# Altium schematic sheet Microcontroller.SchDoc
size Letter
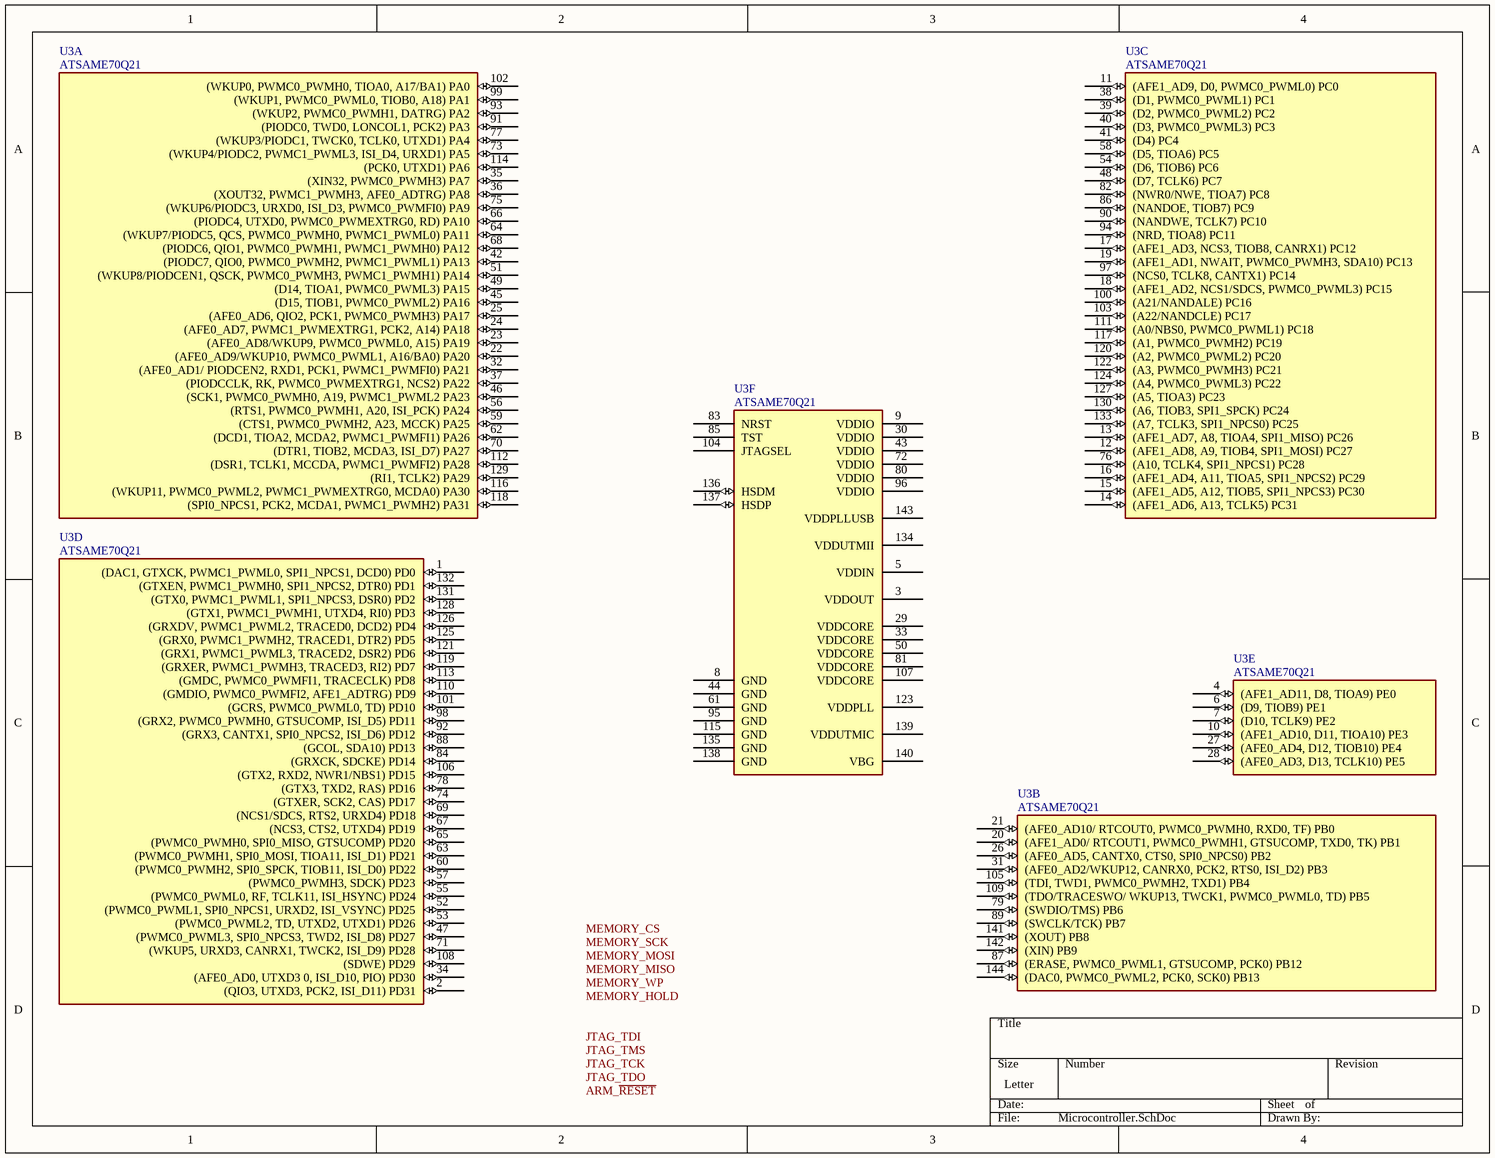
[diagram p0: Microcontroller.SchDoc]

## Parts
U3  ATSAME70Q21  [Atmel 144AA_M]  (parts A,B,C,D,E,F of 6)

## Nets

Not connected (* = marked no-connect by the designer): U3 1((DAC1,_GTXCK,_PWMC1_PWML0,_SPI1_NPCS1,_DCD0)_PD0) 2((QIO3,_UTXD3,_PCK2,_ISI_D11)_PD31) 3(VDDOUT) 4((AFE1_AD11,_D8,_TIOA9)_PE0) 5(VDDIN) 6((D9,_TIOB9)_PE1) 7((D10,_TCLK9)_PE2) 8(GND) 9(VDDIO) 10((AFE1_AD10,_D11,_TIOA10)_PE3) 11((AFE1_AD9,_D0,_PWMC0_PWML0)_PC0) 12((AFE1_AD8,_A9,_TIOB4,_SPI1_MOSI)_PC27) 13((AFE1_AD7,_A8,_TIOA4,_SPI1_MISO)_PC26) 14((AFE1_AD6,_A13,_TCLK5)_PC31) 15((AFE1_AD5,_A12,_TIOB5,_SPI1_NPCS3)_PC30) 16((AFE1_AD4,_A11,_TIOA5,_SPI1_NPCS2)_PC29) 17((AFE1_AD3,_NCS3,_TIOB8,_CANRX1)_PC12) 18((AFE1_AD2,_NCS1/SDCS,_PWMC0_PWML3)_PC15) 19((AFE1_AD1,_NWAIT,_PWMC0_PWMH3,_SDA10)_PC13) 20((AFE1_AD0/_RTCOUT1,_PWMC0_PWMH1,_GTSUCOMP,_TXD0,_TK)_PB1) 21((AFE0_AD10/_RTCOUT0,_PWMC0_PWMH0,_RXD0,_TF)_PB0) 22((AFE0_AD9/WKUP10,_PWMC0_PWML1,_A16/BA0)_PA20) 23((AFE0_AD8/WKUP9,_PWMC0_PWML0,_A15)_PA19) 24((AFE0_AD7,_PWMC1_PWMEXTRG1,_PCK2,_A14)_PA18) 25((AFE0_AD6,_QIO2,_PCK1,_PWMC0_PWMH3)_PA17) 26((AFE0_AD5,_CANTX0,_CTS0,_SPI0_NPCS0)_PB2) 27((AFE0_AD4,_D12,_TIOB10)_PE4) 28((AFE0_AD3,_D13,_TCLK10)_PE5) 29(VDDCORE) 30(VDDIO) 31((AFE0_AD2/WKUP12,_CANRX0,_PCK2,_RTS0,_ISI_D2)_PB3) 32((AFE0_AD1/_PIODCEN2,_RXD1,_PCK1,_PWMC1_PWMFI0)_PA21) 33(VDDCORE) 34((AFE0_AD0,_UTXD3_0,_ISI_D10,_PIO)_PD30) 35((XIN32,_PWMC0_PWMH3)_PA7) 36((XOUT32,_PWMC1_PWMH3,_AFE0_ADTRG)_PA8) 37((PIODCCLK,_RK,_PWMC0_PWMEXTRG1,_NCS2)_PA22) 38((D1,_PWMC0_PWML1)_PC1) 39((D2,_PWMC0_PWML2)_PC2) 40((D3,_PWMC0_PWML3)_PC3) 41((D4)_PC4) 42((PIODC7,_QIO0,_PWMC0_PWMH2,_PWMC1_PWML1)_PA13) 43(VDDIO) 44(GND) 45((D15,_TIOB1,_PWMC0_PWML2)_PA16) 46((SCK1,_PWMC0_PWMH0,_A19,_PWMC1_PWML2_PA23) 47((PWMC0_PWML3,_SPI0_NPCS3,_TWD2,_ISI_D8)_PD27) 48((D7,_TCLK6)_PC7) 49((D14,_TIOA1,_PWMC0_PWML3)_PA15) 50(VDDCORE) 51((WKUP8/PIODCEN1,_QSCK,_PWMC0_PWMH3,_PWMC1_PWMH1)_PA14) 52((PWMC0_PWML1,_SPI0_NPCS1,_URXD2,_ISI_VSYNC)_PD25) 53((PWMC0_PWML2,_TD,_UTXD2,_UTXD1)_PD26) 54((D6,_TIOB6)_PC6) 55((PWMC0_PWML0,_RF,_TCLK11,_ISI_HSYNC)_PD24) 56((RTS1,_PWMC0_PWMH1,_A20,_ISI_PCK)_PA24) 57((PWMC0_PWMH3,_SDCK)_PD23) 58((D5,_TIOA6)_PC5) 59((CTS1,_PWMC0_PWMH2,_A23,_MCCK)_PA25) 60((PWMC0_PWMH2,_SPI0_SPCK,_TIOB11,_ISI_D0)_PD22) 61(GND) 62((DCD1,_TIOA2,_MCDA2,_PWMC1_PWMFI1)_PA26) 63((PWMC0_PWMH1,_SPI0_MOSI,_TIOA11,_ISI_D1)_PD21) 64((WKUP7/PIODC5,_QCS,_PWMC0_PWMH0,_PWMC1_PWML0)_PA11) 65((PWMC0_PWMH0,_SPI0_MISO,_GTSUCOMP)_PD20) 66((PIODC4,_UTXD0,_PWMC0_PWMEXTRG0,_RD)_PA10) 67((NCS3,_CTS2,_UTXD4)_PD19) 68((PIODC6,_QIO1,_PWMC0_PWMH1,_PWMC1_PWMH0)_PA12) 69((NCS1/SDCS,_RTS2,_URXD4)_PD18) 70((DTR1,_TIOB2,_MCDA3,_ISI_D7)_PA27) 71((WKUP5,_URXD3,_CANRX1,_TWCK2,_ISI_D9)_PD28) 72(VDDIO) 73((WKUP4/PIODC2,_PWMC1_PWML3,_ISI_D4,_URXD1)_PA5) 74((GTXER,_SCK2,_CAS)_PD17) 75((WKUP6/PIODC3,_URXD0,_ISI_D3,_PWMC0_PWMFI0)_PA9) 76((A10,_TCLK4,_SPI1_NPCS1)_PC28) 77((WKUP3/PIODC1,_TWCK0,_TCLK0,_UTXD1)_PA4) 78((GTX3,_TXD2,_RAS)_PD16) 79((SWDIO/TMS)_PB6) 80(VDDIO) 81(VDDCORE) 82((NWR0/NWE,_TIOA7)_PC8) 83(NRST) 84((GRXCK,_SDCKE)_PD14) 85(TST) 86((NANDOE,_TIOB7)_PC9) 87((ERASE,_PWMC0_PWML1,_GTSUCOMP,_PCK0)_PB12) 88((GCOL,_SDA10)_PD13) 89((SWCLK/TCK)_PB7) 90((NANDWE,_TCLK7)_PC10) 91((PIODC0,_TWD0,_LONCOL1,_PCK2)_PA3) 92((GRX3,_CANTX1,_SPI0_NPCS2,_ISI_D6)_PD12) 93((WKUP2,_PWMC0_PWMH1,_DATRG)_PA2) 94((NRD,_TIOA8)_PC11) 95(GND) 96(VDDIO) 97((NCS0,_TCLK8,_CANTX1)_PC14) 98((GRX2,_PWMC0_PWMH0,_GTSUCOMP,_ISI_D5)_PD11) 99((WKUP1,_PWMC0_PWML0,_TIOB0,_A18)_PA1) 100((A21/NANDALE)_PC16) 101((GCRS,_PWMC0_PWML0,_TD)_PD10) 102((WKUP0,_PWMC0_PWMH0,_TIOA0,_A17/BA1)_PA0) 103((A22/NANDCLE)_PC17) 104(JTAGSEL) 105((TDI,_TWD1,_PWMC0_PWMH2,_TXD1)_PB4) 106((GTX2,_RXD2,_NWR1/NBS1)_PD15) 107(VDDCORE) 108((SDWE)_PD29) 109((TDO/TRACESWO/_WKUP13,_TWCK1,_PWMC0_PWML0,_TD)_PB5) 110((GMDIO,_PWMC0_PWMFI2,_AFE1_ADTRG)_PD9) 111((A0/NBS0,_PWMC0_PWML1)_PC18) 112((DSR1,_TCLK1,_MCCDA,_PWMC1_PWMFI2)_PA28) 113((GMDC,_PWMC0_PWMFI1,_TRACECLK)_PD8) 114((PCK0,_UTXD1)_PA6) 115(GND) 116((WKUP11,_PWMC0_PWML2,_PWMC1_PWMEXTRG0,_MCDA0)_PA30) 117((A1,_PWMC0_PWMH2)_PC19) 118((SPI0_NPCS1,_PCK2,_MCDA1,_PWMC1_PWMH2)_PA31) 119((GRXER,_PWMC1_PWMH3,_TRACED3,_RI2)_PD7) 120((A2,_PWMC0_PWML2)_PC20) 121((GRX1,_PWMC1_PWML3,_TRACED2,_DSR2)_PD6) 122((A3,_PWMC0_PWMH3)_PC21) 123(VDDPLL) 124((A4,_PWMC0_PWML3)_PC22) 125((GRX0,_PWMC1_PWMH2,_TRACED1,_DTR2)_PD5) 126((GRXDV,_PWMC1_PWML2,_TRACED0,_DCD2)_PD4) 127((A5,_TIOA3)_PC23) 128((GTX1,_PWMC1_PWMH1,_UTXD4,_RI0)_PD3) 129((RI1,_TCLK2)_PA29) 130((A6,_TIOB3,_SPI1_SPCK)_PC24) 131((GTX0,_PWMC1_PWML1,_SPI1_NPCS3,_DSR0)_PD2) 132((GTXEN,_PWMC1_PWMH0,_SPI1_NPCS2,_DTR0)_PD1) 133((A7,_TCLK3,_SPI1_NPCS0)_PC25) 134(VDDUTMII) 135(GND) 136(HSDM) 137(HSDP) 138(GND) 139(VDDUTMIC) 140(VBG) 141((XOUT)_PB8) 142((XIN)_PB9) 143(VDDPLLUSB) 144((DAC0,_PWMC0_PWML2,_PCK0,_SCK0)_PB13)

## Notes on the sheet
- Labels drawn without touching a wire or pin: ARM_~{RESET}, JTAG_TCK, JTAG_TDI, JTAG_TDO, JTAG_TMS, MEMORY_CS, MEMORY_HOLD, MEMORY_MISO, MEMORY_MOSI, MEMORY_SCK, MEMORY_WP

## Library data of the parts
U3 = Atmel SAME70Q21: IC MCU 32BIT 2048KB FLASH; Manufacturer: Atmel; Manufacturer Part Number: ATSAME70Q21A-AN; Core Processor: ARM® Cortex®-M7; Core Size: 32-Bit; Speed: 300MHz; Connectivity: CAN, EBI/EMI, Ethernet, I²C, IrDA, LIN, MMC/SD/SDIO, SPI, UART/USART, USB; Peripherals: Brown-out Detect/Reset, DMA, I²S, POR, PWM, WDT; Number of I/O: 114; Program Memory Size: 2MB (2M x 8); RAM Size: 384K x 8; Voltage - Supply (Vcc/Vdd): 1.62 V ~ 3.6 V; Data Converters: A/D 24x12b, D/A 2x12b; Oscillator Type: Internal; Supplier 1: Digi-Key; RoHS: RoHS Compliant; Category: Integrated Circuits (ICs); Stock 1: 346; Pricing 1: 1=19.29, 10=17.532, 100=14.9022, 250=13.58732, 500=12.7107, 1000=12.175 (USD); Packaging: Tray; Program Memory Type: FLASH; EEPROM Size: -; Operating Temperature: -40°C ~ 105°C; Package / Case: 144-LQFP; Supplier Device Package: 144-LQFP (20x20); ComponentLink1URL: http://www.atmel.com/Images/Atmel-11296-32-bit-Cortex-M7-Microcontroller-SAM-E70Q-SAM-E70N-SAM-E70J_Datasheet.pdf; ComponentLink1Description: http://www.atmel.com/Images/Atmel-11296-32-bit-Cortex-M7-Microcontroller-SAM-E70Q-SAM-E70N-SAM-E70J_Datasheet.pdf